# EAGLE design mkuBoard-045-2B (EAGLE 7.5.0)
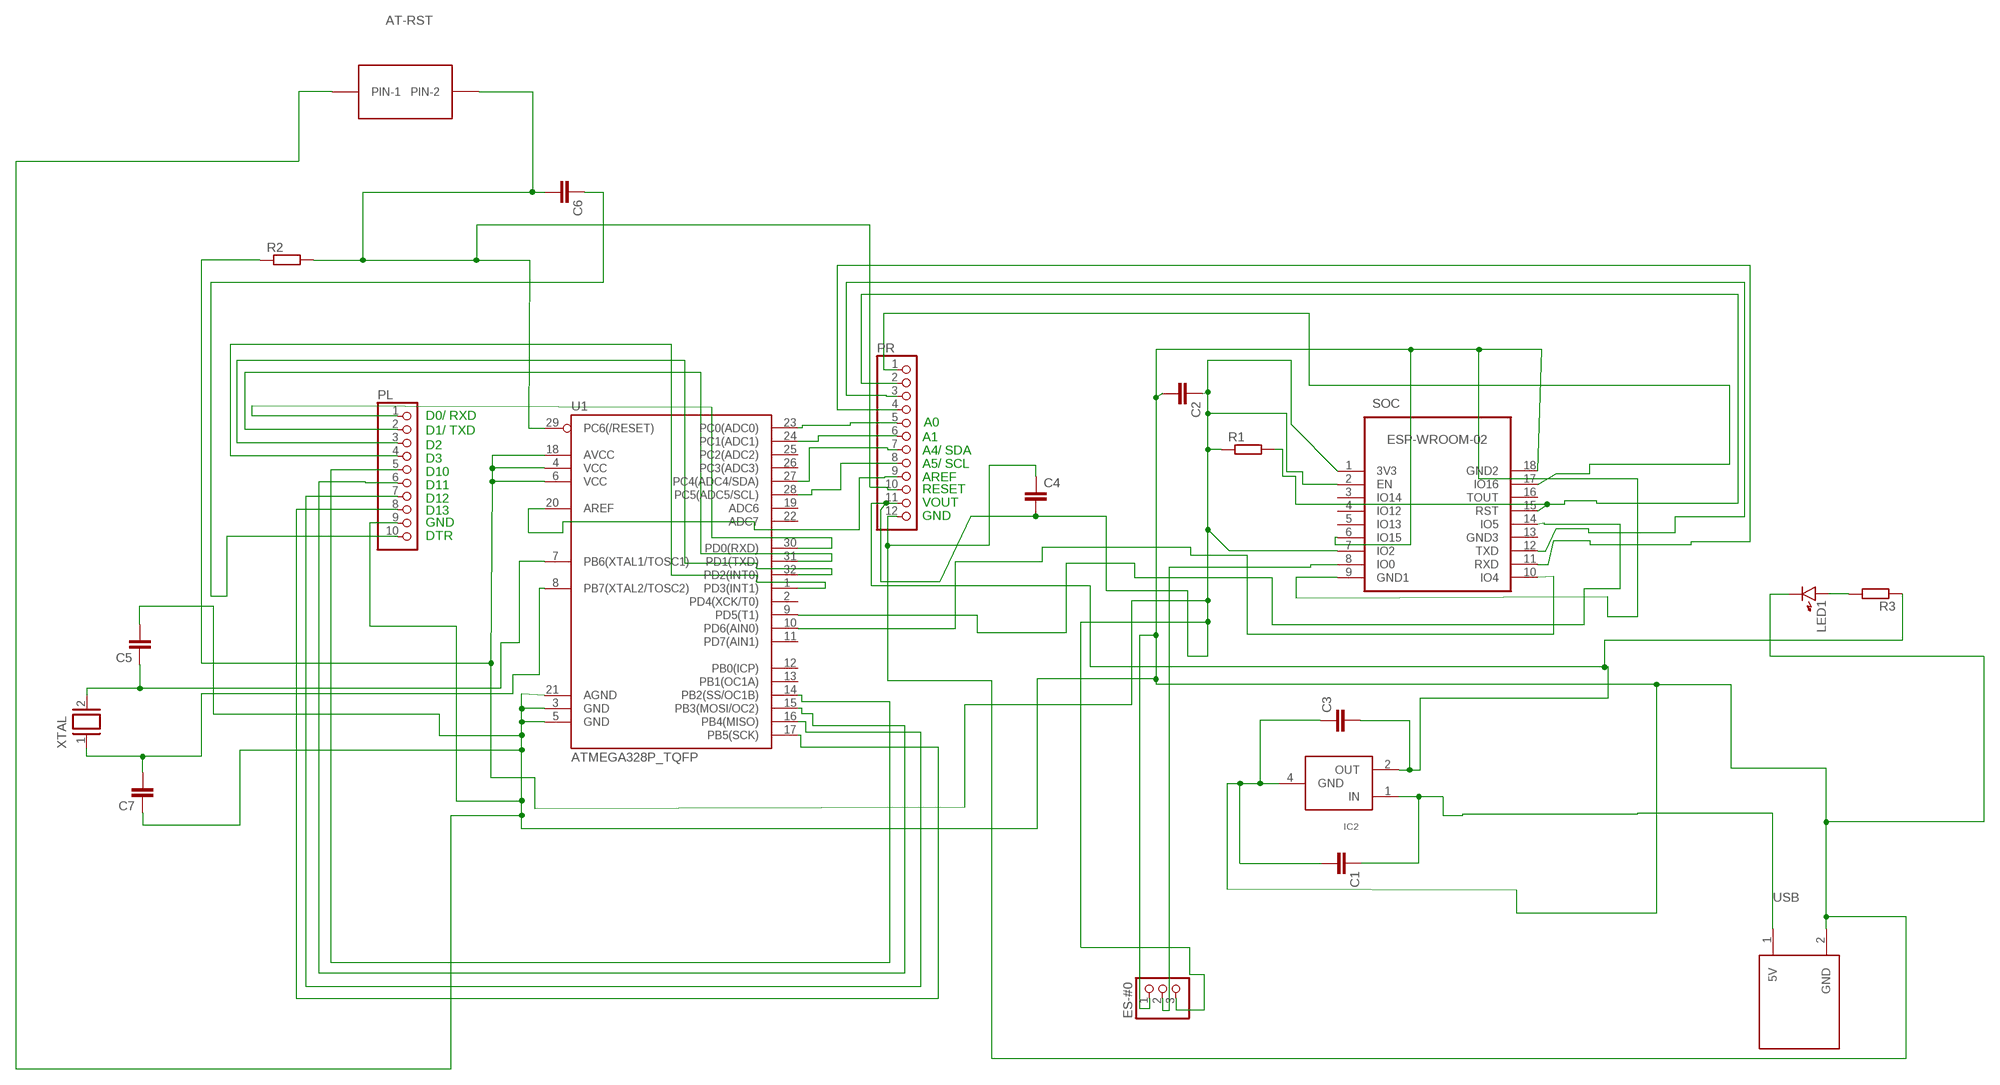
[diagram p0: schematic, sheet 1]

## Parts
AT-RST  BTN2-EX  [B3F-10XX]
C1  C-EUC0603  [C0603]
C2  C-EUC0603  [C0603]
C3  C-EUC1206  [C1206]
C4  C-EUC1206  [C1206]
C5  C-EUC0603  [C0603]
C6  C-EUC0603  [C0603]
C7  C-EUC0603  [C0603]
ES-#0  PINHD-1X3  [1X03]
IC2  NJM2845DL1  [NJM2845DL1-PKG]
LED1  LED1608  [LED1608]
PL  PINHD-1X10  [1X10]
PR  PINHD-1X12  [1X12]
R1  R-EU_R0603  [R0603]
R2  R-EU_R0603  [R0603]
R3  R-EU_R0603  [R0603]
SOC  ESP-WROOM-02  ESP-WROOM-02-CP2FRONT  [FRONT-FACE-CP2]
U1  ATMEGA328P_TQFP  [TQFP32-08]
USB  USB-CUST-1  [USB-CUST-1-PKG]
XTAL  XTAL/S  [QS]

## Nets
N$1: ES-#0.2 SOC.8(IO0)
N$2: PL.1 U1.30(PD0(RXD))
N$3: SOC.14(IO5) U1.9(PD5(T1))
N$5: C1.1 IC2.1(IN) USB.1(5V)
N$6: PR.1 SOC.17(IO16)
N$8: PR.7 U1.27(PC4(ADC4/SDA))
N$9: PR.3 SOC.12(TXD)
N$10: PR.4 SOC.11(RXD)
N$11: PR.8 U1.28(PC5(ADC5/SCL))
N$12: LED1.A R3.2
N$13: PR.2 R1.2 SOC.15(RST)
N$16: C2.1 C3.2 C4.2 ES-#0.3 IC2.2(OUT) PR.11 R1.1 R2.1 R3.1 SOC.1(3V3) SOC.2(EN) SOC.7(IO2) U1.4(VCC) U1.6(VCC) U1.18(AVCC)
N$18: C6.1 PL.10
N$19: PL.2 U1.31(PD1(TXD))
N$20: PL.3 U1.32(PD2(INT0))
N$21: PL.4 U1.1(PD3(INT1))
N$22: AT-RST.1(PIN-1) C1.2 C2.2 C3.1 C4.1 C5.2 C7.1 ES-#0.1 IC2.4(GND) LED1.K PL.9 PR.12 SOC.6(IO15) SOC.9(GND1) SOC.18(GND2) U1.3(GND) U1.5(GND) U1.21(AGND) USB.2(GND)
N$24: SOC.10(IO4) U1.10(PD6(AIN0))
N$28: PL.5 U1.14(PB2(SS/OC1B))
N$29: PL.6 U1.15(PB3(MOSI/OC2))
N$30: PL.7 U1.16(PB4(MISO))
N$31: PL.8 U1.17(PB5(SCK))
N$32: PR.5 U1.23(PC0(ADC0))
N$33: PR.6 U1.24(PC1(ADC1))
N$34: AT-RST.2(PIN-2) C6.2 PR.10 R2.2 U1.29(PC6(/RESET))
N$38: PR.9 U1.20(AREF)
N$40: C5.1 U1.7(PB6(XTAL1/TOSC1)) XTAL.2
N$41: C7.2 U1.8(PB7(XTAL2/TOSC2)) XTAL.1
Unconnected: SOC.3(IO14) SOC.4(IO12) SOC.5(IO13) SOC.13(GND3) SOC.16(TOUT) U1.2(PD4(XCK/T0)) U1.11(PD7(AIN1)) U1.12(PB0(ICP)) U1.13(PB1(OC1A)) U1.19(ADC6) U1.22(ADC7) U1.25(PC2(ADC2)) U1.26(PC3(ADC3))

## Notes on the sheet
- D0/ RXD
- A0
- D1/ TXD
- A1
- D2
- A4/ SDA
- D3
- A5/ SCL
- D10
- AREF
- D11
- RESET
- D12
- VOUT
- D13
- GND
- GND
- DTR

## Library data of the parts
AT-RST = btn2-ex2:BTN2-EX
C1-C7 = resistor:C-EU: CAPACITOR, European symbol
ES-#0 = pinhead:PINHD-1X3: PIN HEADER
IC2 = ic-cust-4:NJM2845DL1
LED1 = generic:LED: Generic LEDs
PL = pinhead:PINHD-1X10: PIN HEADER
PR = pinhead:PINHD-1X12: PIN HEADER
R1-R3 = resistor:R-EU_: RESISTOR, European symbol
SOC = esp-wroom-02-CP2:ESP-WROOM-02-CP2: WiFi module - ESP-WROOM-02
U1 = SparkFun-DigitalIC:ATMEGA328P_TQFP; PROD_ID: IC-09069
USB = usb-cust-2:USB-CUST-1
XTAL = special:XTAL/S: CRYSTAL

## Board
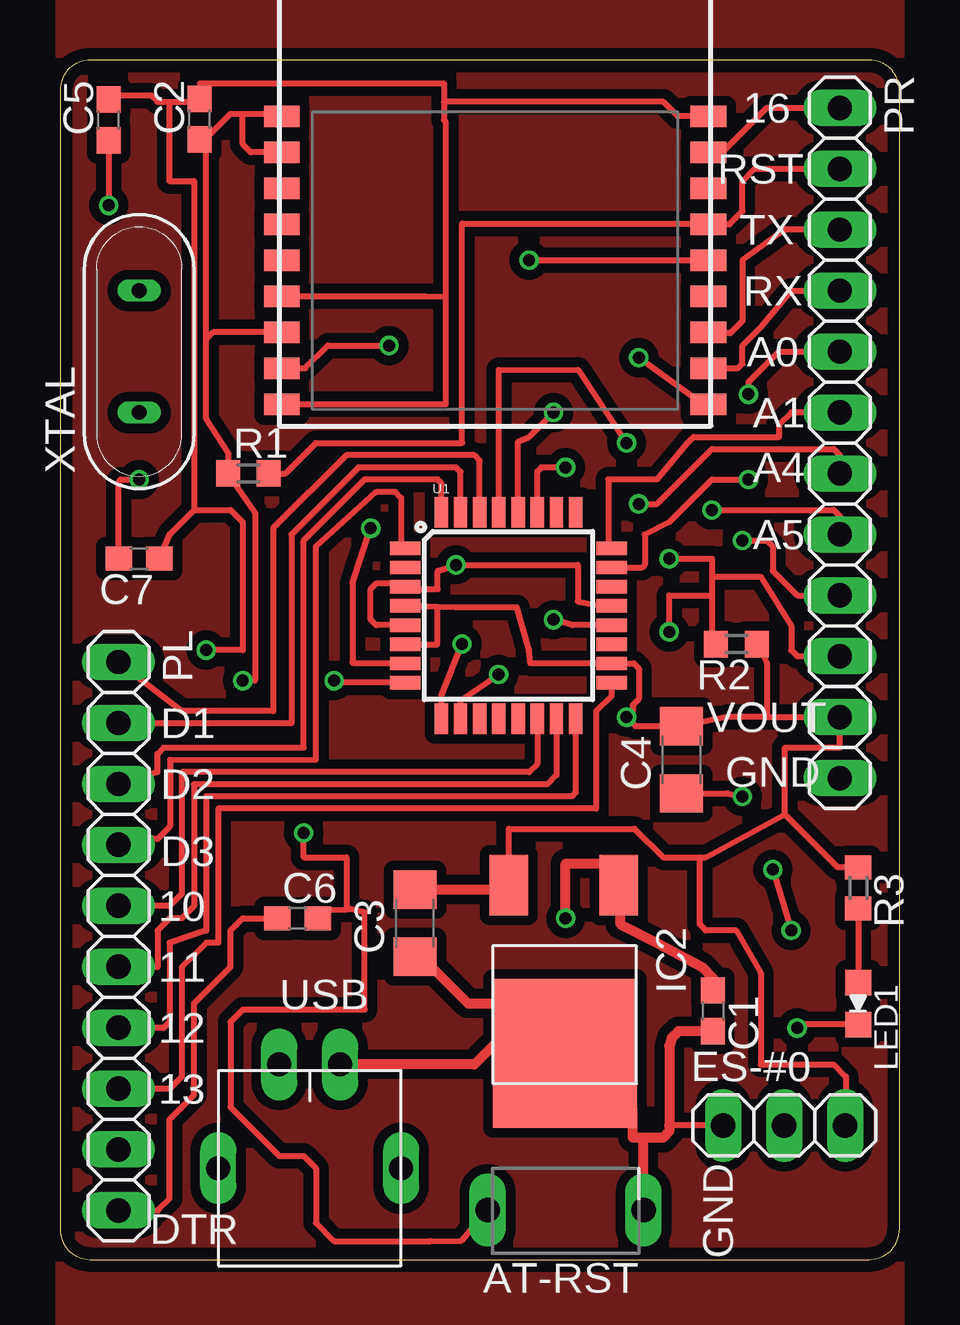
[diagram p1: board, top side]
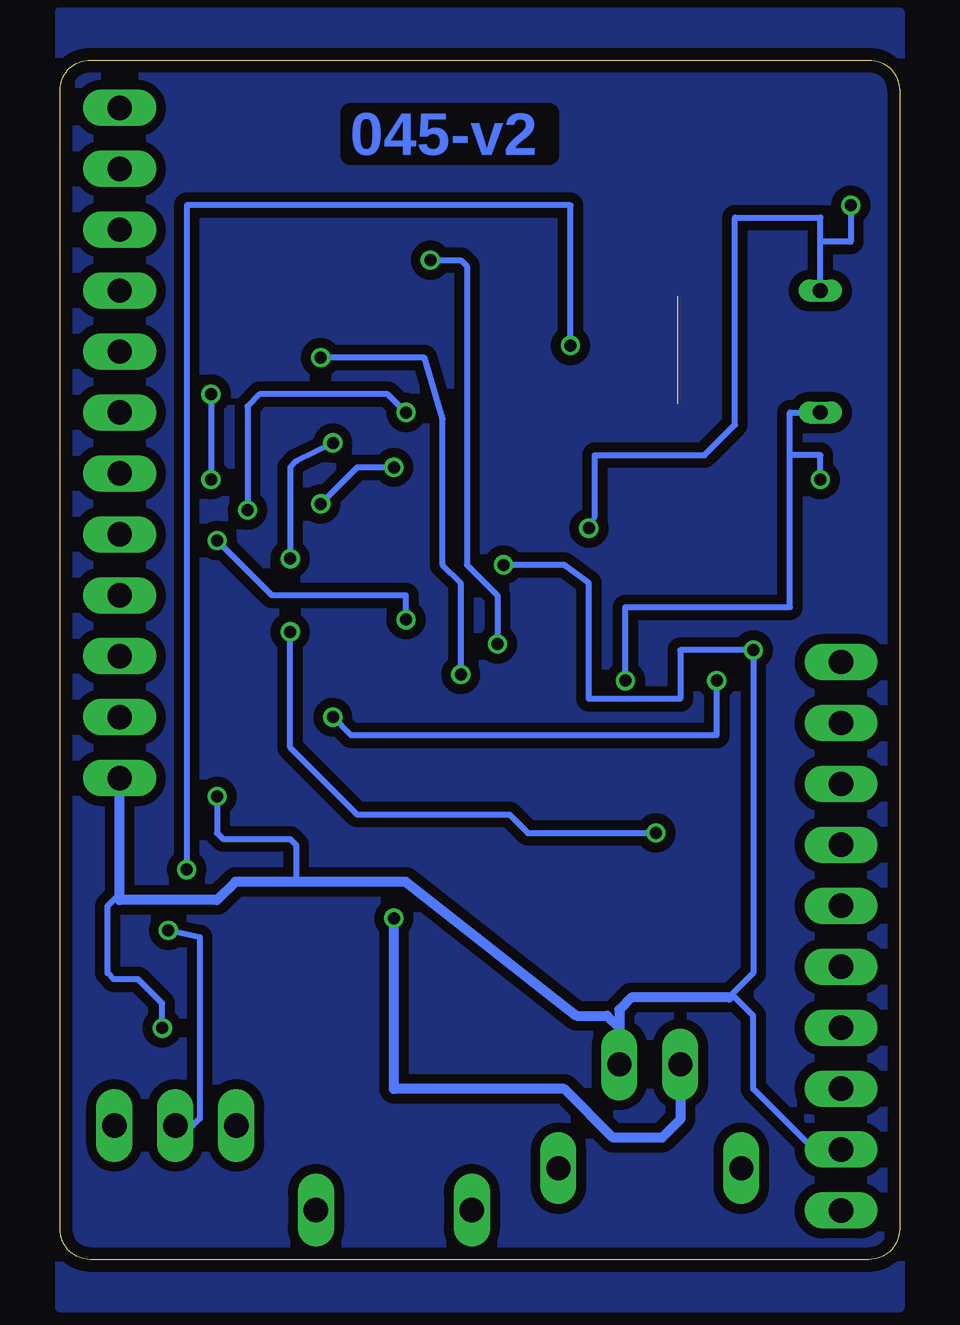
[diagram p2: board, bottom side, seen from below]

Size 35 x 50 mm. Coordinates in mm from the lower left corner, seen from the top.
Outline: 35,1.27 35,48.73 arc90 33.73,50 1.27,50 arc90 0,48.73 0,1.27 arc90 1.27,0 33.73,0 arc90 35,1.27
Copper layers (1*16): Top 0.035mm / dielectric 1.6mm / Bottom 0.035mm
Design rules "Elecrow_2-layer_PCB_eagle_rule": minimum track width 6mil, minimum drill 12mil, track to track 6mil, track to pad 6mil, pad to pad 6mil, via to via 8mil, smd to smd 0mil, copper to edge 20mil, drill to drill 10mil, minimum pad ring 6mil, minimum via ring 6mil, stop-mask expansion 0mil, vias tented up to drill 100mil, thermal gap 10mil

### Footprints (pad centres in the part's own frame; a part is rotated, then mirrored left to right if it is on the bottom)
B3F-10XX = drill 1.016 long: 1 -3.251,1.499; 2 3.251,1.499
C0603 = smd 1.1 x 1: 1 -0.85,0; 2 0.85,0
C1206 = smd 1.6 x 1.8: 1 -1.4,0; 2 1.4,0
1X03 = drill 1.016 long: 1 -2.54,0; 2 0,0; 3 2.54,0
NJM2845DL1-PKG = smd 2.54 x 1.6: 1 -4.27,2.254; 2 -4.27,-2.318 | smd 6.2 x 6: 4 2.746,0.016
LED1608 = smd 1.05 x 1.08: A -0.875,0; K 0.875,0
1X10 = drill 1.016 long: 1 -11.43,0; 2 -8.89,0; 3 -6.35,0; 4 -3.81,0; 5 -1.27,0; 6 1.27,0; 7 3.81,0; 8 6.35,0; 9 8.89,0; 10 11.43,0
1X12 = drill 1.016 long: 1 -13.97,0; 2 -11.43,0; 3 -8.89,0; 4 -6.35,0; 5 -3.81,0; 6 -1.27,0; 7 1.27,0; 8 3.81,0; 9 6.35,0; 10 8.89,0; 11 11.43,0; 12 13.97,0
R0603 = smd 1 x 1.1: 1 -0.85,0; 2 0.85,0
FRONT-FACE-CP2 = smd 1.485 x 0.9: 1 -8.893,4.9; 2 -8.893,3.4; 3 -8.893,1.9; 4 -8.893,0.4; 5 -8.893,-1.1; 6 -8.893,-2.6; 7 -8.893,-4.1; 8 -8.893,-5.6; 9 -8.893,-7.1; 10 8.893,-7.1; 11 8.893,-5.6; 12 8.893,-4.1; 13 8.893,-2.6; 14 8.893,-1.1; 15 8.893,0.4; 16 8.893,1.9; 17 8.893,3.4; 18 8.893,4.9
TQFP32-08 = smd 1.27 x 0.559: 1 -4.293,2.8; 2 -4.293,2; 3 -4.293,1.2; 4 -4.293,0.4; 5 -4.293,-0.4; 6 -4.293,-1.2; 7 -4.293,-2; 8 -4.293,-2.8; 17 4.293,-2.8; 18 4.293,-2; 19 4.293,-1.2; 20 4.293,-0.4; 21 4.293,0.4; 22 4.293,1.2; 23 4.293,2; 24 4.293,2.8 | smd 0.559 x 1.27: 9 -2.8,-4.293; 10 -2,-4.293; 11 -1.2,-4.293; 12 -0.4,-4.293; 13 0.4,-4.293; 14 1.2,-4.293; 15 2,-4.293; 16 2.8,-4.293; 25 2.8,4.293; 26 2,4.293; 27 1.2,4.293; 28 0.4,4.293; 29 -0.4,4.293; 30 -1.2,4.293; 31 -2,4.293; 32 -2.8,4.293
USB-CUST-1-PKG = drill 1 long: 1 -1.27,6.604; 2 1.27,6.604; 3 -3.81,2.286; 4 3.81,2.286
QS = drill 0.61 long: 1 -2.54,0; 2 2.54,0

### Placement (x,y rotation side)
AT-RST  21.08,3.56 180 top
C1  27.22,10.37 270 top
C2  5.82,47.53 90 top
C3  14.8,14.02 90 top
C4  25.91,20.83 90 top
C5  2.03,47.5 90 top
C6  9.91,14.22 0 top
C7  3.3,29.21 180 top
ES-#0  30.19,5.59 0 top
IC2  21.03,11.33 270 top
LED1  33.27,10.67 270 top
PL  2.44,13.47 270 top
PR  32.51,34.04 270 top
R1  7.86,32.77 0 top
R2  28.19,25.65 180 top
R3  33.27,15.49 270 top
SOC  18.14,42.75 0 top
U1  18.7,26.84 0 top
USB  10.41,1.52 0 top
XTAL  3.3,37.85 90 top

### Tracks (layer width: path | path; a pad name or v marks a point on that pad's centre or on a via)
N$1  (via drill 0.5)
  Top 0.254: SOC.8 10.22,37.15 11.18,38.1 v13.72,38.1 | v29.72,16.26 v30.48,13.72
  Bottom 0.254: v13.72,38.1 13.72,43.94 29.72,43.94 v29.72,16.26 | v30.48,13.72 29.18,13.43 29.18,5.88 29.46,5.59 ES-#0.2
N$2
  Top 0.254: U1.30 17.5,33.3 17.27,33.53 11.94,33.53 8.89,30.48 8.89,22.86 5.08,22.86 2.45,24.89 PL.1
N$3  (via drill 0.5)
  Top 0.254: U1.9 15.9,23.52 v16.76,25.65 | v19.56,41.66 SOC.14
  Bottom 0.254: v19.56,41.66 18.29,41.66 18.03,41.4 18.03,28.96 16.76,27.69 v16.76,25.65
N$5  (via drill 0.5)
  Top 0.406: v21.08,14.22 21.08,16.51 23.68,16.51 IC2.1 23.37,16.03 23.37,13.97 24.89,13.21 26.76,12.19 27.22,11.73 C1.1
  Bottom 0.406: USB.1 9.14,5.84 9.91,5.08 11.94,5.08 13.97,7.11 21.08,7.11 v21.08,14.22
N$6
  Top 0.254: SOC.17 27.61,46.15 29.46,48.01 PR.1
N$8  (via drill 0.5)
  Top 0.254: U1.27 19.9,32.85 20.07,33.02 v21.08,33.02 | v24.13,31.5 24.89,31.5 27.18,33.78 32.26,33.78 32.51,33.53 PR.7
  Bottom 0.254: v21.08,33.02 22.61,33.02 v24.13,31.5
N$9
  Top 0.254: PR.3 30.23,42.93 28.45,41.66 28.45,39.12 27.94,38.61 27.07,38.61 SOC.12
N$10
  Top 0.254: SOC.11 28.26,37.15 28.45,37.34 28.45,38.1 29.21,38.86 30.48,40.39 PR.4
N$11  (via drill 0.5)
  Top 0.254: U1.28 19.1,34.08 19.56,34.29 v20.57,35.31 | v27.18,31.24 32.26,31.24 32.51,30.99 PR.8
  Bottom 0.254: v27.18,31.24 27.18,35.56 26.67,36.07 21.34,36.07 v20.57,35.31
N$12
  Top 0.254: R3.2 LED1.A
N$13
  Top 0.254: PR.2 28.96,45.47 28.45,44.96 28.45,43.69 27.91,43.15 SOC.15 27,43.18 16.76,43.18 16.76,34.04 10.67,34.04 9.4,32.77 R1.2
N$14
  pour Bottom (isolate 0.406, no thermals): 0,52 0,-2 35,-2 35,52
N$16  (via drill 0.5)
  Top 0.254: IC2.2 18.71,17.95 23.96,17.95 25.15,16.76 26.67,16.76 | 30.23,18.54 30.23,21.34 32.51,21.34 PR.11 29.46,22.61 | 6.1,38.35 6.1,35.05 7.01,33.63 R1.1 8.13,31.14 8.13,24.13 v7.62,24.13 | 6.1,38.35 6.1,46.41 | 6.1,46.41 C2.1 | 6.1,46.41 6.1,46.74 7.11,47.75 7.62,47.75 | 7.62,47.75 9.14,47.75 SOC.1 | SOC.2 7.95,46.15 7.62,46.48 7.62,47.75 | SOC.7 6.39,38.65 6.1,38.35 | 15.73,27.2 16.5,27.18 19.05,27.18 19.56,25.4 19.61,24.84 U1.18 23.92,24.84 24.13,24.64 24.13,23.37 23.88,23.11 23.88,22.86 v23.62,22.61 24,22.23 C4.2 27.81,22.61 29.46,22.61 | 15.73,27.2 U1.4 | R2.1 29.46,24.89 29.46,22.61 | U1.6 15.74,25.64 15.74,27.2 15.73,27.2 | 26.67,16.76 26.92,16.76 30.23,18.54 | ES-#0.3 32.77,5.62 32.77,7.62 32.26,8.13 29.21,8.13 29.21,11.94 28.19,13.72 26.92,13.72 26.67,13.97 26.67,16.76 | 30.23,18.54 32.42,16.34 R3.1
  Top 0.406: C3.2 18.02,15.42 IC2.2
  Bottom 0.254: v7.62,24.13 7.62,21.84 22.86,21.84 v23.62,22.61
N$17
  pour Top (isolate 0.406, no thermals): 0,54 0,-4 35,-4 35,54
N$18
  Top 0.254: PL.10 4.08,2.04 4.57,2.54 4.57,5.84 5.59,6.86 5.59,10.67 7.11,12.19 7.11,13.72 7.62,14.22 C6.1
N$19
  Top 0.254: U1.31 16.7,32.83 16.51,33.02 12.45,33.02 9.65,30.23 9.65,22.35 2.45,22.35 PL.2
N$20
  Top 0.254: U1.32 15.9,32.36 15.75,32.51 12.7,32.51 10.16,29.97 10.16,21.34 4.32,21.34 4.06,21.08 4.06,20.32 2.45,19.81 PL.3
N$21
  Top 0.254: 14.33,29.72 U1.1 14.22,29.82 14.22,31.75 13.97,32 13.21,32 10.67,29.72 10.67,20.83 4.58,20.84 4.58,18.05 4.06,17.53 2.68,17.53 PL.4
N$22  (via drill 0.5)  (1 unrouted)
  Top 0.254: SOC.6 15.26,40.15 16,40.13 | 5.59,31.24 5.59,44.96 4.57,44.96 4.57,48.26 | SOC.9 16.09,35.65 16.09,47.41 16,47.5 16,48.26 | U1.21 22.93,27.18 21.59,27.43 21.59,28.96 v16.51,28.96 15.75,28.7 15.75,27.94 14.3,27.94 U1.3 14.26,28.19 13.21,28.19 12.95,27.94 12.95,26.67 13.18,26.44 U1.5 | ES-#0.1 25.4,5.59 | C4.1 27.82,19.43 v28.45,19.3 | SOC.18 25.76,47.65 25.15,48.26 16,48.26 | 16,48.26 16,49.02 5.84,49.02 5.84,48.4 C2.2 5.7,48.26 4.57,48.26 | LED1.K 30.88,9.79 v30.73,9.65 | v6.1,25.4 7.62,25.4 7.62,30.73 7.11,31.24 5.59,31.24 | C5.2 2.12,48.51 3.81,48.51 4.06,48.26 4.57,48.26 | C7.1 4.57,30.23 5.59,31.24
  Top 0.406: 23.62,6.1 23.62,6.52 23.58,6.55 | C3.1 15.07,12.62 17.02,10.67 19.48,10.67 IC2.4 | IC2.4 18.24,9.1 17.27,8.13 USB.2 | IC2.4 23.58,6.55 | 24.38,5.08 25.15,5.08 25.4,5.33 25.4,5.59 25.4,8.89 25.52,9.26 25.77,9.52 C1.2 | 24.38,5.08 23.88,5.08 23.88,6.26 23.58,6.55 | AT-RST.1 24.33,5.03 24.38,5.08
  Bottom 0.254: 6.99,11.05 6.1,11.94 v6.1,25.4 9.14,25.4 9.14,23.37 12.95,23.37 12.95,28.19 13.97,28.96 v16.51,28.96 | 6.99,11.05 7.11,10.92 | PL.9 3.57,4.58 6.1,7.11 6.1,10.16 6.99,11.05 | v28.45,19.3 28.45,17.78 28.19,17.53 25.4,17.53 25.15,17.27 25.15,15.75 | v30.73,9.65 30.73,10.67 31.75,11.68 32.77,11.68 33.02,11.94 33.02,14.73 32.51,15.24
  Bottom 0.406: 11.68,9.65 12.19,10.16 13.46,10.16 20.57,15.75 25.15,15.75 27.69,15.75 28.45,14.99 32.51,14.99 32.51,15.24 PR.12 | 11.68,9.65 USB.2 | 7.11,10.92 11.18,10.92 11.68,10.41 11.68,9.65
N$24  (via drill 0.5)
  Top 0.254: U1.10 16.7,23.3 v18.29,24.38 | v24.13,37.59 26.95,35.56 SOC.10
  Bottom 0.254: v18.29,24.38 18.29,28.19 19.05,28.96 19.05,35.05 19.81,37.59 v24.13,37.59
N$28
  Top 0.254: U1.14 19.9,20.66 19.56,20.32 5.08,20.32 5.08,15.24 4.57,14.73 2.45,14.73 PL.5
N$29
  Top 0.254: U1.15 20.7,20.19 20.32,19.81 5.59,19.81 5.59,14.73 5.08,14.22 4.57,14.22 4.06,13.72 4.06,12.19 2.45,12.19 PL.6
N$30
  Top 0.254: U1.16 21.5,19.47 21.34,19.3 6.1,19.3 6.1,13.72 4.57,13.21 4.57,9.91 4.32,9.65 2.45,9.65 PL.7
N$31
  Top 0.254: PL.8 2.45,7.11 4.57,7.11 5.08,7.62 5.08,12.19 6.1,13.21 6.6,13.21 6.6,18.8 22.35,18.8 22.35,22.86 22.99,23.5 U1.17
N$32  (via drill 0.5)
  Top 0.254: PR.5 29.97,37.85 28.7,36.58 v28.7,36.07 | U1.23 24.27,28.84 24.38,28.96 24.38,30.23 25.4,30.73 27.18,32.51 v28.7,32.51
  Bottom 0.254: v28.7,36.07 v28.7,32.51
N$33
  Top 0.254: PR.6 30.48,35.31 29.97,34.8 29.97,34.29 26.42,34.29 26.16,34.04 24.89,32.51 22.86,32.51 22.86,29.77 U1.24
N$34  (via drill 0.5)
  Top 0.254: U1.29 18.3,37.07 21.59,37.08 v23.62,34.04 | 27.18,28.45 27.18,29.21 v25.4,29.21 | 27.18,28.45 27.18,27.69 | C6.2 10.76,14.57 11.96,14.6 | 11.96,14.6 12.06,14.61 12.7,14.48 12.7,10.41 7.62,10.41 7.11,9.91 7.11,6.35 9.14,4.32 10.16,4.32 10.67,3.81 10.67,1.52 11.43,0.76 15.44,0.76 16.74,0.79 AT-RST.2 | v10.16,17.78 10.16,16.76 11.94,16.76 11.94,14.62 11.96,14.6 | v25.4,26.16 25.4,27.69 27.18,27.69 | PR.10 30.73,25.15 30.48,25.4 30.48,26.42 29.21,28.45 27.18,28.45 | 27.43,25.74 R2.2 27.18,25.82 27.18,27.69
  Bottom 0.254: v23.62,34.04 25.15,33.27 25.4,33.02 v25.4,29.21 | v10.16,17.78 15.49,17.78 16.26,18.54 22.61,18.54 25.4,21.34 v25.4,26.16
N$38  (via drill 0.5)
  Top 0.254: U1.20 21.36,26.44 v20.57,26.67 | v28.45,29.97 29.46,29.97 29.72,29.72 29.72,28.7 30.73,27.69 PR.9
  Bottom 0.254: v20.57,26.67 20.57,27.69 26.16,27.69 v28.45,29.97
N$40  (via drill 0.5)
  Top 0.254: U1.7 12.24,24.84 12.19,24.89 12.19,28.19 v12.95,30.48 | C5.1 v2.03,43.94
  Bottom 0.254: v12.95,30.48 12.7,30.99 12.7,33.53 8.13,33.53 6.86,34.8 6.86,43.43 3.3,43.43 3.3,42.42 | XTAL.2 3.3,42.42 | v2.03,43.94 2.03,42.42 3.3,42.42
N$41  (via drill 0.5)
  Top 0.254: U1.8 11.52,24.04 v11.43,24.13 | C7.2 2.45,32.42 2.54,32.51 v3.3,32.51
  Bottom 0.254: v11.43,24.13 11.43,27.18 4.57,27.18 4.57,33.53 | v3.3,32.51 3.3,33.53 4.57,33.53 | 4.57,33.53 4.57,35.31 XTAL.1

### Text on the board
Bottom: 045-v2
tNames: 16 | RST | TX | RX | A0 | A1 | A4 | A5 | VOUT | D1 | D2 | GND | D3 | 10 | 11 | 12 | 13 | GND | DTR